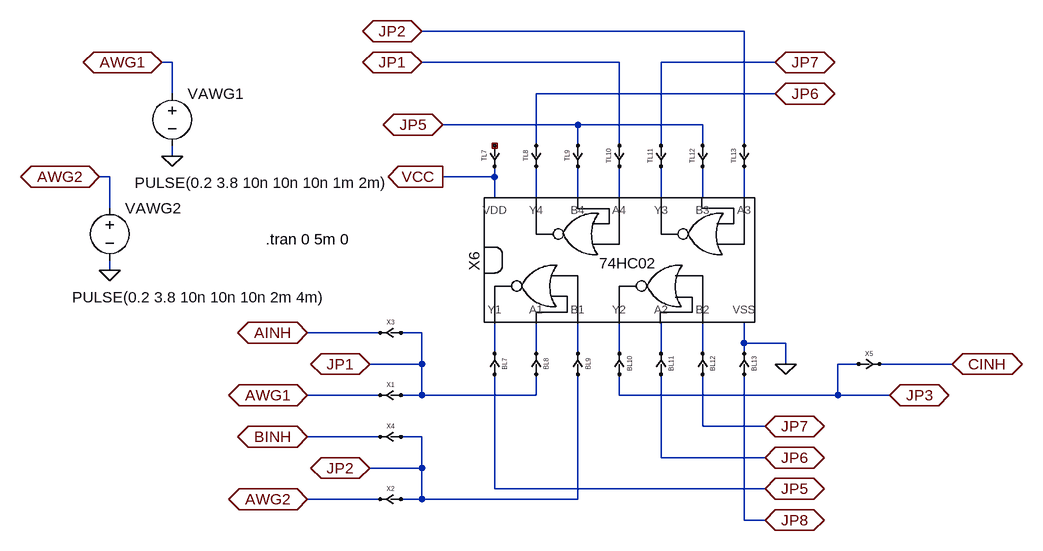
[diagram p0: schematic xnor-from-nor.asc]
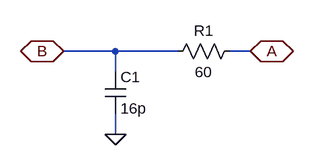
[diagram p1: sub-circuit cross_point.asc]
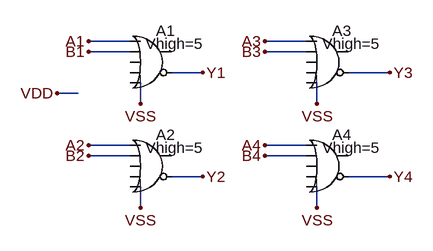
[diagram p2: sub-circuit 74hc02.asc]
xnor-from-nor.asc, the LTspice schematic file:
Version 4
SHEET 1 884 680
WIRE 448 -192 -48 -192
WIRE -432 -144 -448 -144
WIRE 256 -144 -48 -144
WIRE 496 -144 320 -144
WIRE -432 -96 -432 -144
WIRE 496 -96 128 -96
WIRE 192 -48 -16 -48
WIRE 384 -48 192 -48
WIRE 128 -16 128 -96
WIRE 192 -16 192 -48
WIRE 256 -16 256 -144
WIRE 320 -16 320 -144
WIRE 384 -16 384 -48
WIRE 448 -16 448 -192
WIRE -432 0 -432 -16
WIRE -528 32 -544 32
WIRE 64 32 64 16
WIRE 64 32 -16 32
WIRE 64 64 64 32
WIRE 128 64 128 16
WIRE 192 64 192 16
WIRE 256 64 256 16
WIRE 320 64 320 16
WIRE 384 64 384 16
WIRE 448 64 448 16
WIRE -528 80 -528 32
WIRE -528 176 -528 160
WIRE -112 272 -224 272
WIRE -48 272 -80 272
WIRE 448 288 448 256
WIRE 512 288 448 288
WIRE 64 304 64 256
WIRE 128 304 128 256
WIRE 192 304 192 256
WIRE 256 304 256 256
WIRE 320 304 320 256
WIRE 384 304 384 256
WIRE 448 304 448 288
WIRE -48 320 -48 272
WIRE -48 320 -128 320
WIRE 512 320 512 288
WIRE 624 320 592 320
WIRE 768 320 656 320
WIRE -112 368 -224 368
WIRE -48 368 -48 320
WIRE -48 368 -80 368
WIRE 128 368 128 336
WIRE 128 368 -48 368
WIRE 256 368 256 336
WIRE 592 368 592 320
WIRE 592 368 256 368
WIRE 672 368 592 368
WIRE 384 416 384 336
WIRE 480 416 384 416
WIRE -112 432 -224 432
WIRE -48 432 -80 432
WIRE 320 464 320 336
WIRE 480 464 320 464
WIRE -48 480 -48 432
WIRE -48 480 -128 480
WIRE 64 512 64 336
WIRE 480 512 64 512
WIRE -112 528 -224 528
WIRE -48 528 -48 480
WIRE -48 528 -80 528
WIRE 192 528 192 336
WIRE 192 528 -48 528
WIRE 448 560 448 336
WIRE 480 560 448 560
FLAG -224 368 AWG1
IOPIN -224 368 BiDir
FLAG -224 528 AWG2
IOPIN -224 528 BiDir
FLAG -16 32 VCC
IOPIN -16 32 Out
FLAG 512 320 0
FLAG -128 320 JP1
IOPIN -128 320 BiDir
FLAG -128 480 JP2
IOPIN -128 480 BiDir
FLAG -48 -144 JP1
IOPIN -48 -144 BiDir
FLAG -48 -192 JP2
IOPIN -48 -192 BiDir
FLAG -224 272 AINH
IOPIN -224 272 BiDir
FLAG -224 432 BINH
IOPIN -224 432 BiDir
FLAG 672 368 JP3
IOPIN 672 368 BiDir
FLAG 768 320 CINH
IOPIN 768 320 BiDir
FLAG -16 -48 JP5
IOPIN -16 -48 BiDir
FLAG 496 -96 JP6
IOPIN 496 -96 BiDir
FLAG 480 464 JP6
IOPIN 480 464 BiDir
FLAG 480 512 JP5
IOPIN 480 512 BiDir
FLAG 496 -144 JP7
IOPIN 496 -144 BiDir
FLAG 480 416 JP7
IOPIN 480 416 BiDir
FLAG -432 0 0
FLAG -448 -144 AWG1
IOPIN -448 -144 BiDir
FLAG -528 176 0
FLAG -544 32 AWG2
IOPIN -544 32 BiDir
FLAG 480 560 JP8
IOPIN 480 560 BiDir
SYMBOL cross_point 64 320 R90
SYMATTR InstName BL7
SYMBOL cross_point 128 320 R90
SYMATTR InstName BL8
SYMBOL cross_point 192 320 R90
SYMATTR InstName BL9
SYMBOL cross_point 256 320 R90
SYMATTR InstName BL10
SYMBOL cross_point 320 320 R90
SYMATTR InstName BL11
SYMBOL cross_point 384 320 R90
SYMATTR InstName BL12
SYMBOL cross_point 448 320 R90
SYMATTR InstName BL13
SYMBOL cross_point 448 0 R270
SYMATTR InstName TL13
SYMBOL cross_point 384 0 R270
SYMATTR InstName TL12
SYMBOL cross_point 320 0 R270
SYMATTR InstName TL11
SYMBOL cross_point 256 0 R270
SYMATTR InstName TL10
SYMBOL cross_point 192 0 R270
SYMATTR InstName TL9
SYMBOL cross_point 128 0 R270
SYMATTR InstName TL8
SYMBOL cross_point 64 0 R270
SYMATTR InstName TL7
SYMBOL cross_point -96 368 R0
SYMATTR InstName X1
SYMBOL cross_point -96 528 R0
SYMATTR InstName X2
SYMBOL cross_point -96 272 R0
SYMATTR InstName X3
SYMBOL cross_point -96 432 R0
SYMATTR InstName X4
SYMBOL cross_point 640 320 M0
SYMATTR InstName X5
SYMBOL voltage -432 -112 R0
WINDOW 123 0 0 Left 0
WINDOW 39 0 0 Left 0
WINDOW 3 -58 153 Left 2
SYMATTR Value PULSE(0.2 3.8 10n 10n 10n 1m 2m)
SYMATTR InstName VAWG1
SYMBOL voltage -528 64 R0
WINDOW 123 0 0 Left 0
WINDOW 39 0 0 Left 0
WINDOW 3 -58 153 Left 2
SYMATTR Value PULSE(0.2 3.8 10n 10n 10n 2m 4m)
SYMATTR InstName VAWG2
SYMBOL 74hc02 256 160 R0
SYMATTR InstName X6
TEXT -288 128 Left 2 !.tran 0 5m 0

cross_point.asc, the sub-circuit schematic file:
Version 4
SHEET 1 880 680
WIRE 80 160 0 160
WIRE 176 160 80 160
WIRE 288 160 256 160
WIRE 80 192 80 160
WIRE 80 288 80 256
FLAG 288 160 A
IOPIN 288 160 BiDir
FLAG 0 160 B
IOPIN 0 160 BiDir
FLAG 80 288 0
SYMBOL res 272 144 R90
WINDOW 0 0 56 VBottom 2
WINDOW 3 32 56 VTop 2
SYMATTR InstName R1
SYMATTR Value 60
SYMBOL cap 64 192 R0
SYMATTR InstName C1
SYMATTR Value 16p

74hc02.asc, the sub-circuit schematic file:
Version 4
SHEET 1 1612 680
WIRE 256 0 192 0
WIRE 528 0 464 0
WIRE 256 16 192 16
WIRE 528 16 464 16
WIRE 368 48 320 48
WIRE 656 48 592 48
WIRE 176 80 144 80
WIRE 272 96 272 64
WIRE 544 96 544 64
WIRE 256 160 192 160
WIRE 528 160 464 160
WIRE 256 176 192 176
WIRE 528 176 464 176
WIRE 368 208 320 208
WIRE 656 208 592 208
WIRE 272 256 272 224
WIRE 544 256 544 224
FLAG 368 48 Y1
FLAG 368 208 Y2
FLAG 656 48 Y3
FLAG 656 208 Y4
FLAG 192 0 A1
FLAG 192 160 A2
FLAG 464 0 A3
FLAG 464 160 A4
FLAG 192 16 B1
FLAG 192 176 B2
FLAG 464 16 B3
FLAG 464 176 B4
FLAG 272 96 VSS
FLAG 544 96 VSS
FLAG 544 256 VSS
FLAG 272 256 VSS
FLAG 144 80 VDD
SYMBOL Digital\\or 288 -32 R0
WINDOW 3 -8 36 Left 2
SYMATTR Value Vhigh=5
SYMATTR InstName A1
SYMBOL Digital\\or 288 128 R0
WINDOW 3 -8 36 Left 2
SYMATTR Value Vhigh=5
SYMATTR InstName A2
SYMBOL Digital\\or 560 -32 R0
WINDOW 3 -8 36 Left 2
SYMATTR Value Vhigh=5
SYMATTR InstName A3
SYMBOL Digital\\or 560 128 R0
WINDOW 3 -8 36 Left 2
SYMATTR Value Vhigh=5
SYMATTR InstName A4

The netlist it stands for:
* xnor-from-nor.asc
XBL7 JP5 N007 cross_point
XBL8 JP1 N008 cross_point
XBL9 JP2 N009 cross_point
XBL10 JP3 N010 cross_point
XBL11 JP6 N011 cross_point
XBL12 JP7 N012 cross_point
XBL13 JP8 0 cross_point
XTL13 JP2 N006 cross_point
XTL12 JP5 N005 cross_point
XTL11 JP7 N004 cross_point
XTL10 JP1 N003 cross_point
XTL9 JP5 N002 cross_point
XTL8 JP6 N001 cross_point
XTL7 NC_01 VCC cross_point
XX1 JP1 AWG1 cross_point
XX2 JP2 AWG2 cross_point
XX3 JP1 AINH cross_point
XX4 JP2 BINH cross_point
XX5 JP3 CINH cross_point
VAWG1 AWG1 0 PULSE(0.2 3.8 10n 10n 10n 1m 2m)
VAWG2 AWG2 0 PULSE(0.2 3.8 10n 10n 10n 2m 4m)
XX6 N008 N009 N007 N011 N012 N010 0 N001 N002 N003 N004 N005 N006 VCC 74hc02 params: 74HC02

* block symbol definitions
.subckt cross_point A B
R1 A B 60
C1 B 0 16p
.ends cross_point

.subckt 74hc02 A1 B1 Y1 A2 B2 Y2 VSS Y4 B4 A4 Y3 B3 A3 VDD
A1 A1 B1 VSS VSS VSS Y1 VSS VSS OR Vhigh=5
A2 A2 B2 VSS VSS VSS Y2 VSS VSS OR Vhigh=5
A3 A3 B3 VSS VSS VSS Y3 VSS VSS OR Vhigh=5
A4 A4 B4 VSS VSS VSS Y4 VSS VSS OR Vhigh=5
.ends 74hc02

.tran 0 5m 0
.backanno
.end